# EAGLE design MainBoard5 (EAGLE 5.10)
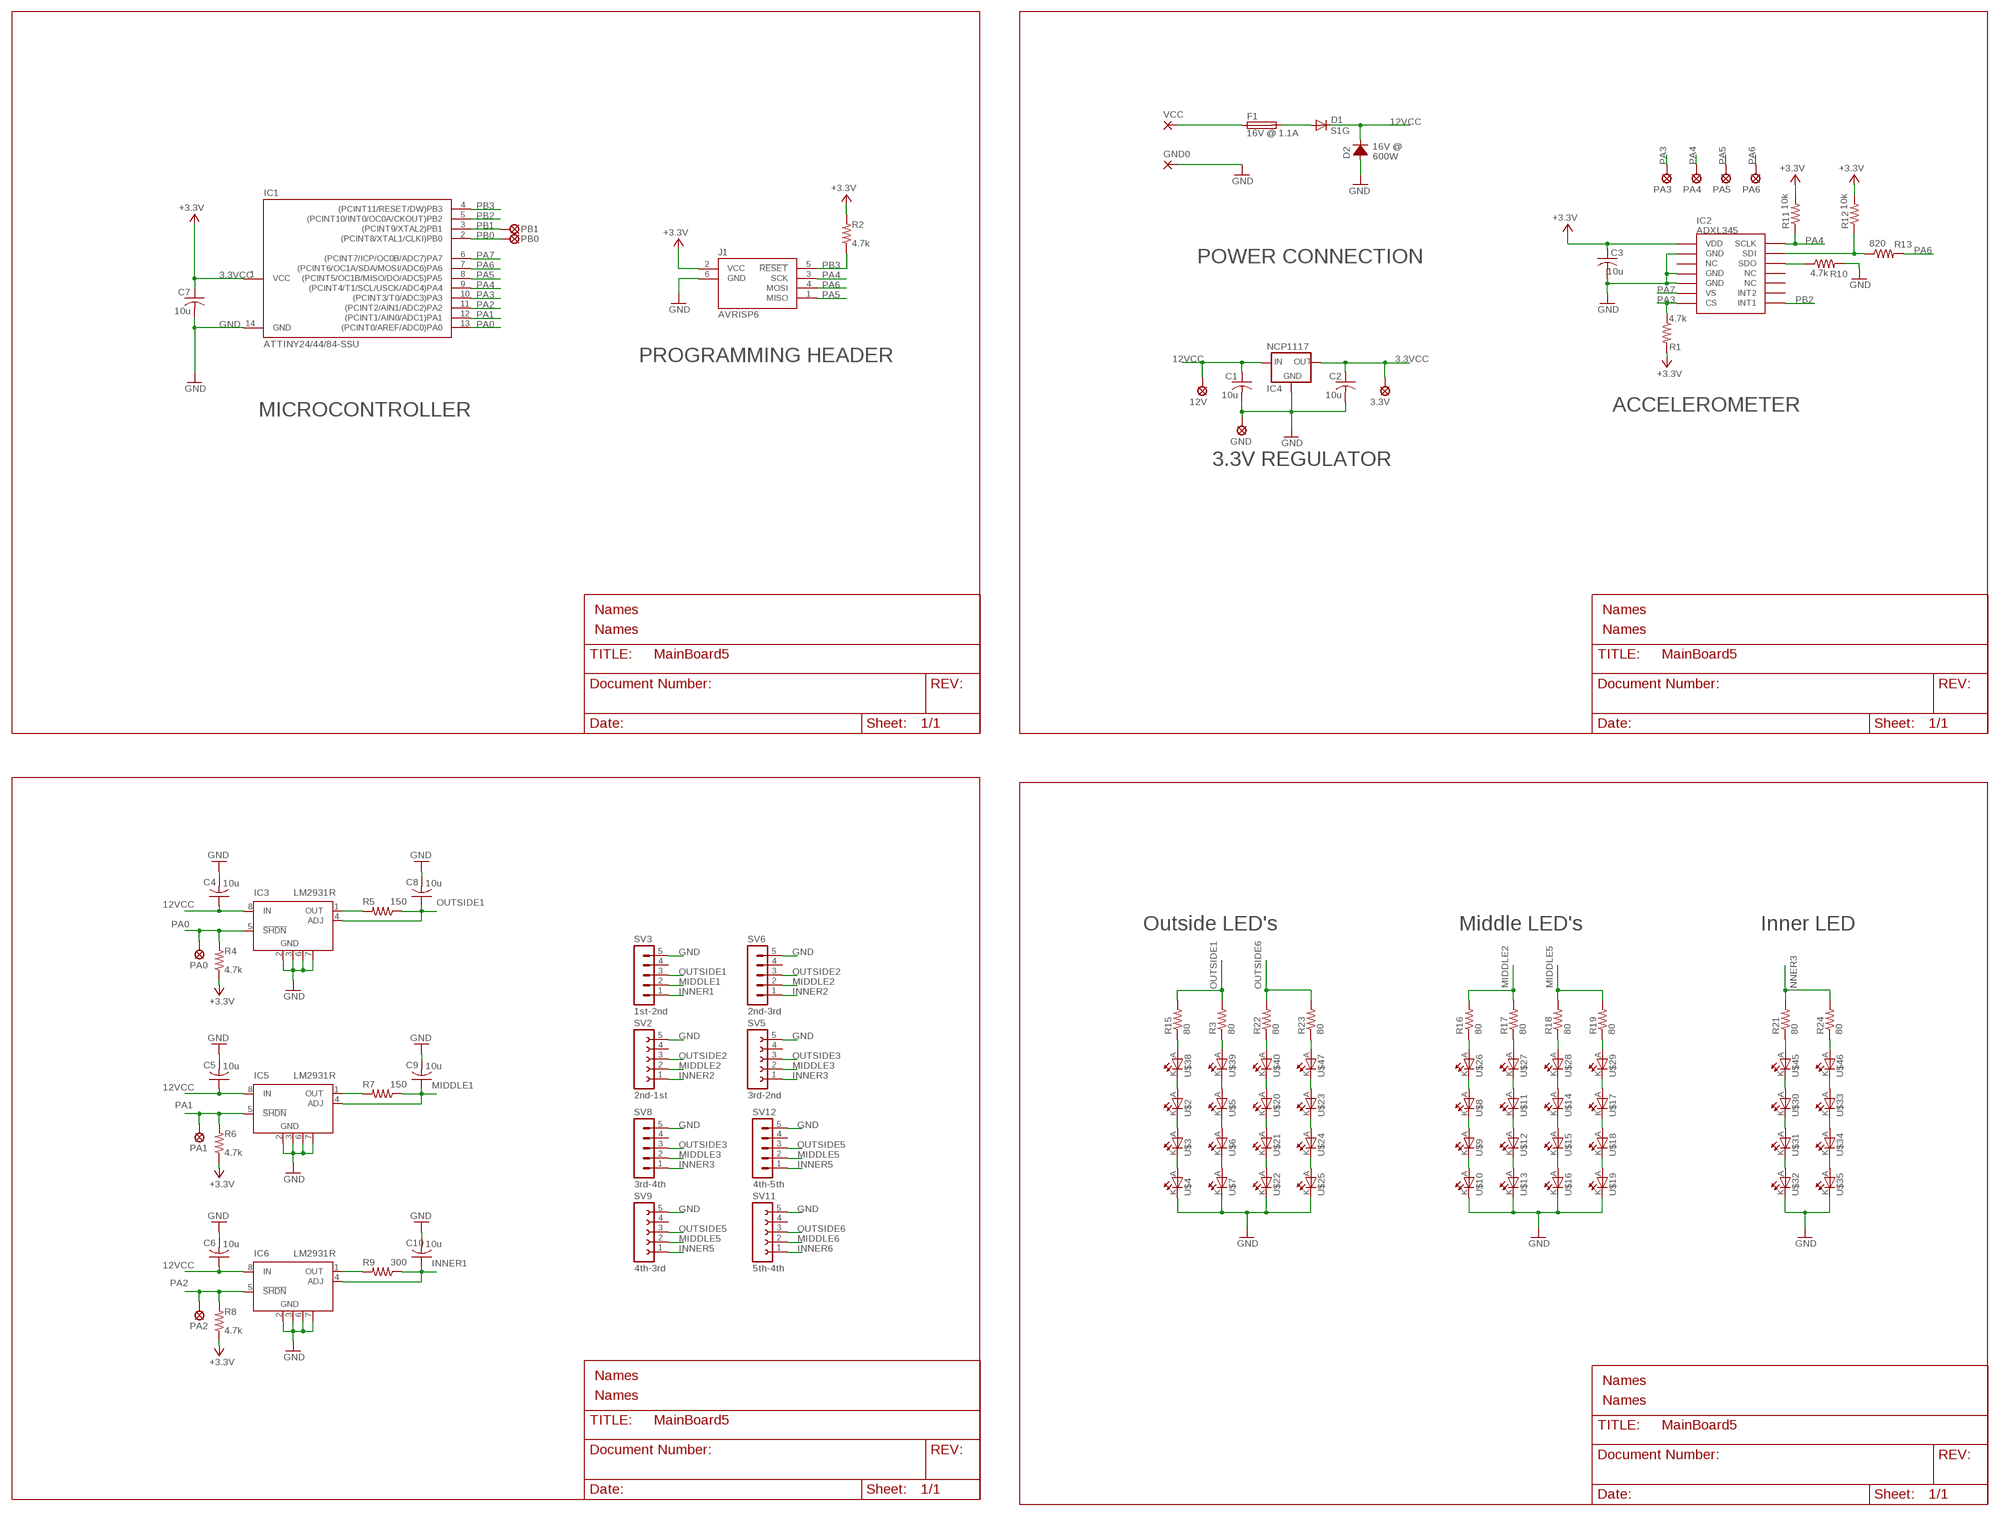
[diagram p0: schematic, sheet 1]

## Parts
3.3V  LSP10  [LSP10]
12V  LSP10  [LSP10]
C1  10u  C-USC0805  [C0805]
C2  10u  C-USC0805  [C0805]
C3  10u  C-USC0805  [C0805]
C4  10u  C-USC0805  [C0805]
C5  10u  C-USC0805  [C0805]
C6  10u  C-USC0805  [C0805]
C7  10u  C-USC0805  [C0805]
C8  10u  C-USC0805  [C0805]
C9  10u  C-USC0805  [C0805]
C10  10u  C-USC0805  [C0805]
D1  S1G  DIODE-DO-214AC  [DO-214AC]
D2  DIODEDO214AA  [DO214AA]
F1  16V @ 1.1A  FUSELITTELFUSE1812  [LITTELFUSE1812]
GND  LSP10  [LSP10]
GND0  WIREPAD2,15/1,0  [2,15/1,0]
IC1  ATTINY24/44/84-SSU  [SOIC14]
IC2  ADXL345  [LGA14]
IC3  LM2931R  [SOIC8]
IC4  NCP1117  LD1117DPAK  [DPAK]
IC5  LM2931R  [SOIC8]
IC6  LM2931R  [SOIC8]
J1  AVRISP6  [CON6P2R]
PA0  LSP10  [LSP10]
PA1  LSP10  [LSP10]
PA2  LSP10  [LSP10]
PA3  LSP10  [LSP10]
PA4  LSP10  [LSP10]
PA5  LSP10  [LSP10]
PA6  LSP10  [LSP10]
PB0  LSP10  [LSP10]
PB1  LSP10  [LSP10]
R1  4.7k  R-US_R0805  [R0805]
R2  4.7k  R-US_R0805  [R0805]
R3  80  R-US_R0805  [R0805]
R4  4.7k  R-US_R0805  [R0805]
R5  150  R-US_R0805  [R0805]
R6  4.7k  R-US_R0805  [R0805]
R7  150  R-US_R0805  [R0805]
R8  4.7k  R-US_R0805  [R0805]
R9  300  R-US_R0805  [R0805]
R10  4.7k  R-US_R0805  [R0805]
R11  10k  R-US_R0805  [R0805]
R12  10k  R-US_R0805  [R0805]
R13  820  R-US_R0805  [R0805]
R15  80  R-US_R0805  [R0805]
R16  80  R-US_R0805  [R0805]
R17  80  R-US_R0805  [R0805]
R18  80  R-US_R0805  [R0805]
R19  80  R-US_R0805  [R0805]
R21  80  R-US_R0805  [R0805]
R22  80  R-US_R0805  [R0805]
R23  80  R-US_R0805  [R0805]
R24  80  R-US_R0805  [R0805]
SV2  2nd-1st  FE05-1  [FE05-1]
SV3  1st-2nd  MA05-1  [MA05-1]
SV5  3rd-2nd  FE05-1  [FE05-1]
SV6  2nd-3rd  MA05-1  [MA05-1]
SV8  3rd-4th  MA05-1  [MA05-1]
SV9  4th-3rd  FE05-1  [FE05-1]
SV11  5th-4th  FE05-1  [FE05-1]
SV12  4th-5th  MA05-1  [MA05-1]
U$2  LED5.0MM  [LED5.0MM]
U$3  LED5.0MM  [LED5.0MM]
U$4  LED5.0MM  [LED5.0MM]
U$5  LED5.0MM  [LED5.0MM]
U$6  LED5.0MM  [LED5.0MM]
U$7  LED5.0MM  [LED5.0MM]
U$8  LED5.0MM  [LED5.0MM]
U$9  LED5.0MM  [LED5.0MM]
U$10  LED5.0MM  [LED5.0MM]
U$11  LED5.0MM  [LED5.0MM]
U$12  LED5.0MM  [LED5.0MM]
U$13  LED5.0MM  [LED5.0MM]
U$14  LED5.0MM  [LED5.0MM]
U$15  LED5.0MM  [LED5.0MM]
U$16  LED5.0MM  [LED5.0MM]
U$17  LED5.0MM  [LED5.0MM]
U$18  LED5.0MM  [LED5.0MM]
U$19  LED5.0MM  [LED5.0MM]
U$20  LED5.0MM  [LED5.0MM]
U$21  LED5.0MM  [LED5.0MM]
U$22  LED5.0MM  [LED5.0MM]
U$23  LED5.0MM  [LED5.0MM]
U$24  LED5.0MM  [LED5.0MM]
U$25  LED5.0MM  [LED5.0MM]
U$26  LED5.0MM  [LED5.0MM]
U$27  LED5.0MM  [LED5.0MM]
U$28  LED5.0MM  [LED5.0MM]
U$29  LED5.0MM  [LED5.0MM]
U$30  LED5.0MM  [LED5.0MM]
U$31  LED5.0MM  [LED5.0MM]
U$32  LED5.0MM  [LED5.0MM]
U$33  LED5.0MM  [LED5.0MM]
U$34  LED5.0MM  [LED5.0MM]
U$35  LED5.0MM  [LED5.0MM]
U$38  LED5.0MM  [LED5.0MM]
U$39  LED5.0MM  [LED5.0MM]
U$40  LED5.0MM  [LED5.0MM]
U$45  LED5.0MM  [LED5.0MM]
U$46  LED5.0MM  [LED5.0MM]
U$47  LED5.0MM  [LED5.0MM]
VCC  WIREPAD2,15/1,0  [2,15/1,0]

## Nets
3.3VCC: 3.3V.MP C2.1 C3.1 C7.1 IC1.1(VCC) IC2.VDD IC4.3(OUT) J1.2(VCC) R1.2 R2.2 R4.1 R6.1 R8.1 R11.2 R12.2 ; supply symbol labelled +3.3V
12VCC: 12V.MP C1.1 C4.1 C5.1 C6.1 D1.C D2.C IC3.8(IN) IC4.2(IN) IC5.8(IN) IC6.8(IN)
GND: C1.2 C2.2 C3.2 C4.2 C5.2 C6.2 C7.2 C8.2 C9.2 C10.2 D2.A GND0.1(P) GND.MP IC1.14(GND) IC2.GND$1(GND) IC2.GND$2(GND) IC2.GND$3(GND) IC3.2(GND) IC3.3(GND) IC3.6(GND) IC3.7(GND) IC4.1(GND) IC5.2(GND) IC5.3(GND) IC5.6(GND) IC5.7(GND) IC6.2(GND) IC6.3(GND) IC6.6(GND) IC6.7(GND) J1.6(GND) R10.2 SV2.5 SV3.5 SV5.5 SV6.5 SV8.5 SV9.5 SV11.5 SV12.5 U$4.K(C) U$7.K(C) U$10.K(C) U$13.K(C) U$16.K(C) U$19.K(C) U$22.K(C) U$25.K(C) U$32.K(C) U$35.K(C)
INNER1: C10.1 IC6.4(ADJ) R9.1 SV3.1
INNER2: SV2.1 SV6.1
INNER3: R21.2 R24.2 SV5.1 SV8.1
INNER5: SV9.1 SV12.1
INNER6: SV11.1
MIDDLE1: C9.1 IC5.4(ADJ) R7.1 SV3.2
MIDDLE2: R16.2 R17.2 SV2.2 SV6.2
MIDDLE3: SV5.2 SV8.2
MIDDLE5: R18.2 R19.2 SV9.2 SV12.2
MIDDLE6: SV11.2
N$1: F1.P$1 VCC.1(P)
N$2: IC3.1(OUT) R5.2
N$3: U$3.K(C) U$4.A
N$4: U$2.K(C) U$3.A
N$5: IC2.SDO R10.1
N$6: IC6.1(OUT) R9.2
N$7: IC2.SDI R12.1 R13.1
N$9: IC5.1(OUT) R7.2
N$11: U$2.A U$38.K(C)
N$12: U$5.A U$39.K(C)
N$13: U$9.K(C) U$10.A
N$14: U$6.K(C) U$7.A
N$15: U$5.K(C) U$6.A
N$16: U$20.A U$40.K(C)
N$17: U$8.K(C) U$9.A
N$18: U$12.K(C) U$13.A
N$19: U$11.K(C) U$12.A
N$20: U$23.A U$47.K(C)
N$21: U$15.K(C) U$16.A
N$22: U$14.K(C) U$15.A
N$23: U$18.K(C) U$19.A
N$24: R15.1 U$38.A
N$25: R3.1 U$39.A
N$26: U$17.K(C) U$18.A
N$28: U$8.A U$26.K(C)
N$29: U$11.A U$27.K(C)
N$30: U$14.A U$28.K(C)
N$31: U$17.A U$29.K(C)
N$32: R16.1 U$26.A
N$33: R17.1 U$27.A
N$34: R18.1 U$28.A
N$35: U$21.K(C) U$22.A
N$36: U$20.K(C) U$21.A
N$37: R22.1 U$40.A
N$38: R19.1 U$29.A
N$39: D1.A F1.P$2
N$40: U$24.K(C) U$25.A
N$41: U$23.K(C) U$24.A
N$42: R23.1 U$47.A
N$43: U$31.K(C) U$32.A
N$44: U$30.K(C) U$31.A
N$45: U$34.K(C) U$35.A
N$46: U$33.K(C) U$34.A
N$52: U$30.A U$45.K(C)
N$53: U$33.A U$46.K(C)
N$56: R21.1 U$45.A
N$57: R24.1 U$46.A
OUTSIDE1: C8.1 IC3.4(ADJ) R3.2 R5.1 R15.2 SV3.3
OUTSIDE2: SV2.3 SV6.3
OUTSIDE3: SV5.3 SV8.3
OUTSIDE5: SV9.3 SV12.3
OUTSIDE6: R22.2 R23.2 SV11.3
PA0: IC1.13((PCINT0/AREF/ADC0)PA0) IC3.5(!SHDN) PA0.MP R4.2
PA1: IC1.12((PCINT1/AIN0/ADC1)PA1) IC5.5(!SHDN) PA1.MP R6.2
PA2: IC1.11((PCINT2/AIN1/ADC2)PA2) IC6.5(!SHDN) PA2.MP R8.2
PA3: IC1.10((PCINT3/T0/ADC3)PA3) IC2.CS PA3.MP R1.1
PA4: IC1.9((PCINT4/T1/SCL/USCK/ADC4)PA4) IC2.SCLK J1.3(SCK) PA4.MP R11.1
PA5: IC1.8((PCINT5/OC1B/MISO/DO/ADC5)PA5) J1.1(MISO) PA5.MP
PA6: IC1.7((PCINT6/OC1A/SDA/MOSI/ADC6)PA6) J1.4(MOSI) PA6.MP R13.2
PA7: IC1.6((PCINT7/ICP/OC0B/ADC7)PA7) IC2.VS
PB0: IC1.2((PCINT8/XTAL1/CLKI)PB0) PB0.MP
PB1: IC1.3((PCINT9/XTAL2)PB1) PB1.MP
PB2: IC1.5((PCINT10/INT0/OC0A/CKOUT)PB2) IC2.INT1
PB3: IC1.4((PCINT11/RESET/DW)PB3) J1.5(!RESET) R2.1
Unconnected: IC2.INT2 IC2.NC$1(NC) IC2.NC$2(NC) IC2.NC$3(NC) SV2.4 SV3.4 SV5.4 SV6.4 SV8.4 SV9.4 SV11.4 SV12.4

## Notes on the sheet
- 16V @
- 600W
- POWER CONNECTION
- PROGRAMMING HEADER
- MICROCONTROLLER | ACCELEROMETER
- 3.3V REGULATOR
- Names | Names
- Names | Names
- Outside LED's | Middle LED's | Inner LED
- Names
- Names
- Names
- Names

## Library data of the parts
3.3V 12V GND PA0 PA1-PA6 PB0 PB1 = solpad:LSP10: SOLDER PAD drill 1.0 mm, distributor Buerklin, 12H555
C1-C10 = rcl:C-US: CAPACITOR, American symbol
D1 = diode:DIODE-: DIODE
D2 = ads4:DIODE: Diode Contains packages not in Eagle libraries
F1 = ads4:FUSE: Fuse
GND0 VCC = wirepad:WIREPAD: Wire PAD connect wire on PCB
IC1 = attiny24_44_84:ATTINY24/44/84
IC2 = tt_pulse:ADXL345
IC3 IC5 IC6 = linear-technology_pace:LM2931R
IC4 = ads4:LD1117: Fixed 3-terminal voltage regulator
J1 = ads4:AVRISP6: 6-pin dual-row connector for Atmel AVRISP programmer interface
R1-R13 R15-R19 R21-R24 = rcl:R-US_: RESISTOR, American symbol
SV2 SV5 SV9 SV11 = con-lsta:FE05-1: FEMALE HEADER; OC_FARNELL: unknown; OC_NEWARK: unknown
SV3 SV6 SV8 SV12 = con-lstb:MA05-1: PIN HEADER; OC_FARNELL: unknown; OC_NEWARK: unknown
U$2-U$35 U$38-U$40 U$45-U$47 = led:LED5.0MM

## Board
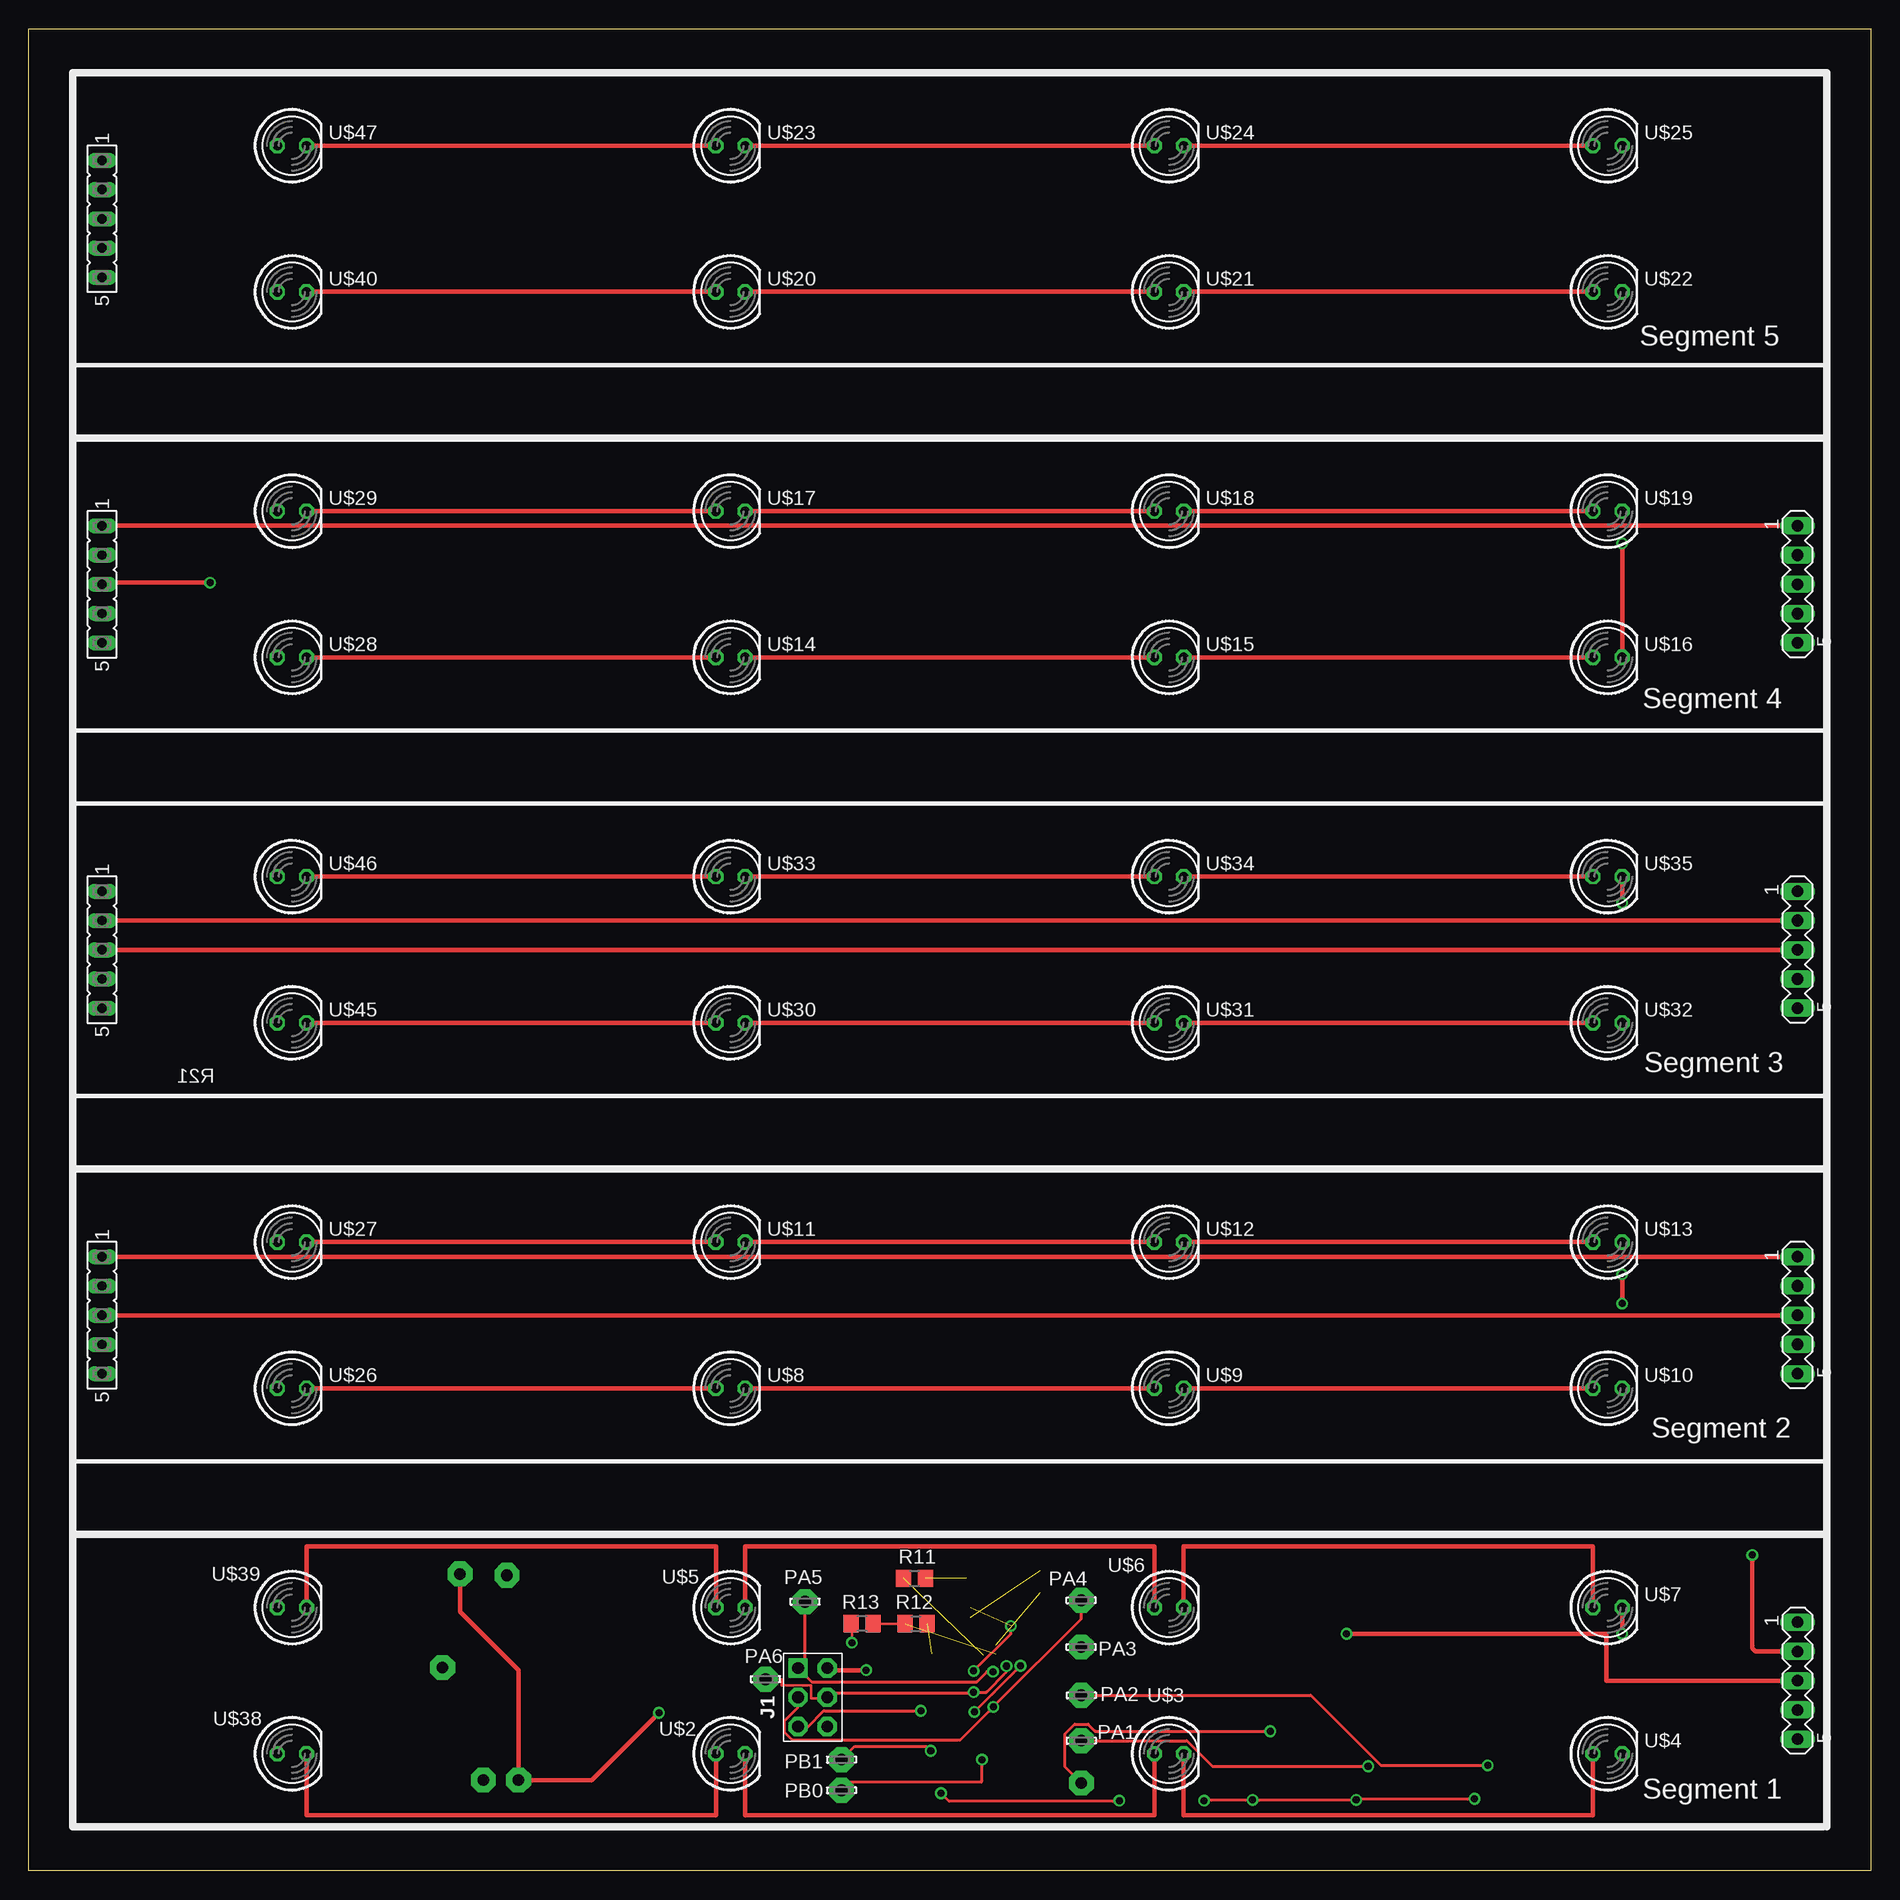
[diagram p1: board, top side]
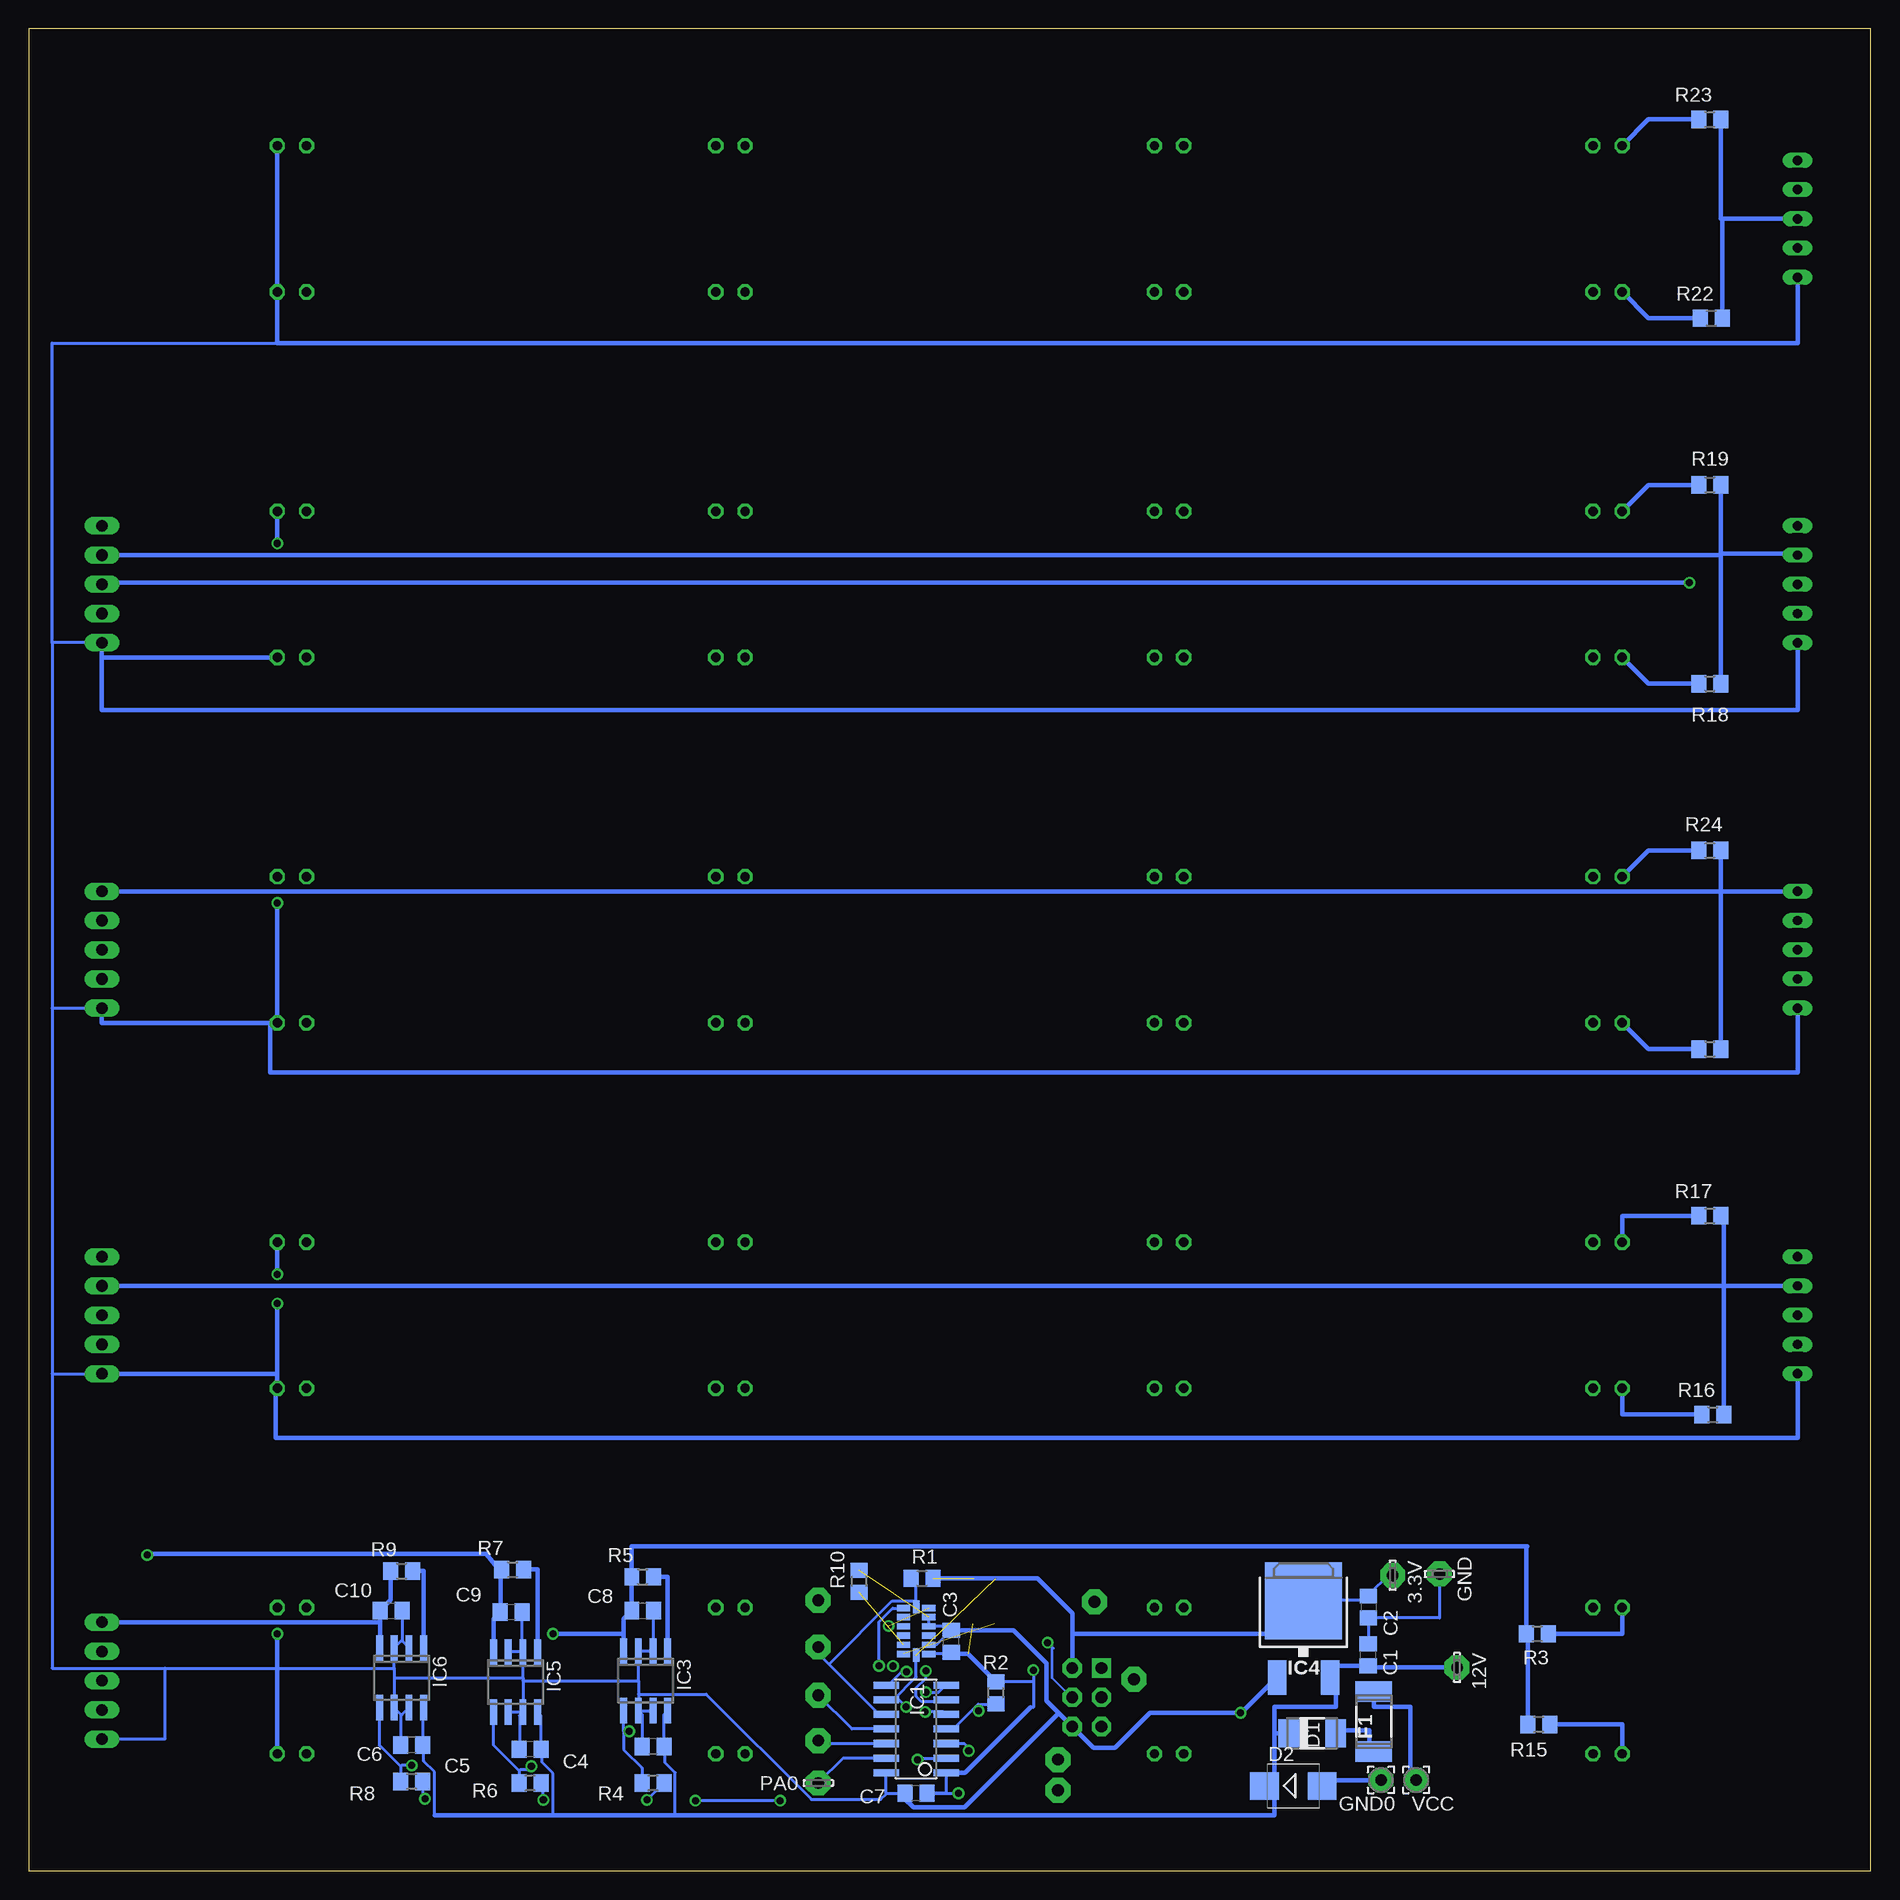
[diagram p2: board, bottom side, seen from below]

Size 160.02 x 160.02 mm. Coordinates in mm from the lower left corner, seen from the top.
Outline: 0,0 0,160.02 160.02,160.02 160.02,0 0,0
Copper layers (1*16): Top 0.035mm / dielectric 1.5mm / Bottom 0.035mm
Design rules "fab": minimum track width 8mil, minimum drill 24mil, track to track 8mil, track to pad 8mil, pad to pad 8mil, via to via 8mil, smd to smd 8mil, copper to edge 20mil, drill to drill 8mil, minimum pad ring 10mil, minimum via ring 8mil, stop-mask expansion 0mil, vias tented up to drill 0mil, thermal gap 10mil

### Footprints (pad centres in the part's own frame; a part is rotated, then mirrored left to right if it is on the bottom)
LSP10 = drill 1.016 pad 2.159 octagon: MP 0,0
C0805 = smd 1.3 x 1.5: 1 -0.95,0; 2 0.95,0
DO-214AC = smd 1.8 x 2.4: A 2.025,0; C -2.025,0
DO214AA = smd 2.5 x 2.4: A 2.5,0; C -2.5,0
LITTELFUSE1812 = smd 1.778 x 3.15: P$1 2.603,0; P$2 -2.603,0
2,15/1,0 = drill 1.016 pad 2.159 octagon: 1 0,0
SOIC14 = smd 0.61 x 2.21: 1 -3.81,-2.603; 2 -2.54,-2.603; 3 -1.27,-2.603; 4 0,-2.603; 5 1.27,-2.603; 6 2.54,-2.603; 7 3.81,-2.603; 8 3.81,2.603; 9 2.54,2.603; 10 1.27,2.603; 11 0,2.603; 12 -1.27,2.603; 13 -2.54,2.603; 14 -3.81,2.603
LGA14 = smd 0.55 x 1.145: CS 0,-2.098; SCLK 0,2.098 | smd 1.145 x 0.55: GND$1 -1.097,1.2; GND$2 -1.097,-0.4; GND$3 -1.097,-1.2; INT1 1.097,-2; INT2 1.097,-1.2; NC$1 -1.097,0.4; NC$2 1.097,-0.4; NC$3 1.097,0.4; SDI 1.097,2; SDO 1.097,1.2; VDD -1.097,2; VS -1.097,-2
SOIC8 = smd 0.6 x 2.2: 1 -1.905,-2.6; 2 -0.635,-2.6; 3 0.635,-2.6; 4 1.905,-2.6; 5 1.905,2.6; 6 0.635,2.6; 7 -0.635,2.6; 8 -1.905,2.6
DPAK = smd 1.6 x 3: 1 -2.3,-4.8; 2 2.3,-4.8 | smd 6.7 x 6.7: 3 0,1.86
CON6P2R = drill 1.016 pad 1.676 square: 1 -2.54,-1.27 | drill 1.016 pad 1.676 octagon: 2 -2.54,1.27; 3 0,-1.27; 4 0,1.27; 5 2.54,-1.27; 6 2.54,1.27
R0805 = smd 1.3 x 1.5: 1 -0.95,0; 2 0.95,0
FE05-1 = drill 0.813 long: 1 -5.08,0; 2 -2.54,0; 3 0,0; 4 2.54,0; 5 5.08,0
MA05-1 = drill 1.016 long: 1 -5.08,0; 2 -2.54,0; 3 0,0; 4 2.54,0; 5 5.08,0
LED5.0MM = drill 0.813 octagon: A -1.27,0; K 1.27,0

### Placement (x,y rotation side)
3.3V  41.53,25.65 270 bottom
12V  35.94,17.65 270 bottom
C1  43.66,18.75 90 bottom
C2  43.64,22.91 270 bottom
C3  79.88,19.94 90 bottom
C4  105.79,10.79 180 bottom
C5  116.46,10.54 180 bottom
C6  126.75,10.92 180 bottom
C7  82.93,6.73 180 bottom
C8  106.68,22.61 0 bottom
C9  118.11,22.48 0 bottom
C10  128.52,22.61 0 bottom
D1  48.51,11.94 0 bottom
D2  50.16,7.37 0 bottom
F1  43.18,12.95 90 bottom
GND  37.47,25.78 0 bottom
GND0  42.55,7.87 0 bottom
IC1  82.93,12.32 90 bottom
IC2  82.93,20.83 180 bottom
IC3  106.43,16.51 180 bottom
IC4  49.28,21.59 0 bottom
IC5  117.73,16.38 180 bottom
IC6  127.64,16.76 180 bottom
J1  68.1,15.06 270 top
PA0  91.44,7.62 0 bottom
PA1  91.44,11.3 0 top
PA2  91.44,15.24 0 top
PA3  91.44,19.43 180 top
PA4  91.44,23.5 180 top
PA5  67.44,23.37 180 top
PA6  64.01,16.64 180 top
PB0  70.61,6.99 0 top
PB1  70.61,9.65 0 top
R1  82.42,25.4 0 bottom
R2  76,15.44 90 bottom
R3  28.96,20.57 180 bottom
R4  105.79,7.62 180 bottom
R5  106.68,25.53 0 bottom
R6  116.46,7.62 180 bottom
R7  117.98,26.16 0 bottom
R8  126.75,7.75 180 bottom
R9  127.64,26.04 0 bottom
R10  87.88,25.15 90 bottom
R11  76.96,25.4 0 top
R12  77.09,21.46 0 top
R13  72.39,21.46 180 top
R15  28.83,12.7 180 bottom
R16  13.72,39.62 0 bottom
R17  13.97,56.9 0 bottom
R18  13.97,103.12 0 bottom
R19  13.97,120.4 0 bottom
R21  13.97,71.37 0 bottom
R22  13.84,134.87 0 bottom
R23  13.97,152.15 0 bottom
R24  13.97,88.65 0 bottom
SV2  6.35,48.26 270 top
SV3  153.67,16.51 270 top
SV5  6.35,80.01 270 top
SV6  153.67,48.26 270 top
SV8  153.67,80.01 270 top
SV9  6.35,111.76 270 top
SV11  6.35,143.51 270 top
SV12  153.67,111.76 270 top
U$2  60.96,10.16 0 top
U$3  99.06,10.16 0 top
U$4  137.16,10.16 0 top
U$5  60.96,22.86 0 top
U$6  99.06,22.86 0 top
U$7  137.16,22.86 0 top
U$8  60.96,41.91 0 top
U$9  99.06,41.91 0 top
U$10  137.16,41.91 0 top
U$11  60.96,54.61 0 top
U$12  99.06,54.61 0 top
U$13  137.16,54.61 0 top
U$14  60.96,105.41 0 top
U$15  99.06,105.41 0 top
U$16  137.16,105.41 0 top
U$17  60.96,118.11 0 top
U$18  99.06,118.11 0 top
U$19  137.16,118.11 0 top
U$20  60.96,137.16 0 top
U$21  99.06,137.16 0 top
U$22  137.16,137.16 0 top
U$23  60.96,149.86 0 top
U$24  99.06,149.86 0 top
U$25  137.16,149.86 0 top
U$26  22.86,41.91 0 top
U$27  22.86,54.61 0 top
U$28  22.86,105.41 0 top
U$29  22.86,118.11 0 top
U$30  60.96,73.66 0 top
U$31  99.06,73.66 0 top
U$32  137.16,73.66 0 top
U$33  60.96,86.36 0 top
U$34  99.06,86.36 0 top
U$35  137.16,86.36 0 top
U$38  22.86,10.16 0 top
U$39  22.86,22.86 0 top
U$40  22.86,137.16 0 top
U$45  22.86,73.66 0 top
U$46  22.86,86.36 0 top
U$47  22.86,149.86 0 top
VCC  39.5,7.87 0 bottom

### Tracks (layer width: path | path; a pad name or v marks a point on that pad's centre or on a via)
3.3VCC  (via drill 0.61)  (2 unrouted)
  Top 0.254: v125.6,6.25 115.39,6.25 v115.32,6.15 v106.32,6.15 102.16,6.15 v102.11,6.1 | v79.25,6.73 79.88,6.1 v94.74,6.1
  Top 0.406: J1.2 69.55,17.42 v72.75,17.42
  Bottom 0.254: 79.88,18.83 IC2.VDD | 80.09,8.69 80.21,8.56 IC1.1 80.33,6.73 C7.1 v79.25,6.73 | 3.3V.MP 41.86,25.65 43.51,24.13 C2.1 43.74,23.8 44.07,23.47 49.28,23.47 IC4.3 49.38,23.39 | R2.2 76,16.41 | R2.2 75.92,16.31 | 81.81,25.7 81.74,25.78 R1.2 81.71,25.04 | R4.1 v106.32,6.15 v106.31,6.15 R4.1 | v115.32,6.15 115.32,7.44 115.49,7.62 | v125.6,6.25 125.78,6.43 125.78,7.75 R8.1 | v94.74,6.1 v102.11,6.1 | 73.02,14.18 72.75,14.18 v72.75,17.42 72.75,16.39 R2.2
  Bottom 0.406: 49.38,23.39 52.2,20.57 69.37,20.57 | 69.37,20.57 J1.2 | 69.37,20.57 69.37,22.38 72.39,25.4 R1.2 | 115.49,7.62 R6.1 | 73.02,14.18 78.69,8.51 IC1.1 | R2.2 78.43,18.83 79.88,18.83 C3.1
12VCC
  Bottom 0.254: D2.C 51.82,7.37 51.82,7.62 | IC6.8 125.73,14.15 125.78,14.1 125.78,10.92 C6.1 125.7,10.82 125.7,9.53 124.77,8.59 124.77,4.83 | IC5.8 115.82,13.77 115.52,13.46 C5.1 115.44,10.44 115.44,9.42 114.48,8.46 114.48,4.83 | IC3.8 104.52,13.89 104.83,13.59 104.83,10.79 C4.1 104.75,10.69 104.75,9.4 103.86,8.51 103.86,4.83
  Bottom 0.406: 51.82,11.94 D1.C | 51.82,11.94 51.82,14.22 46.47,14.22 46.47,16.2 IC4.2 46.98,17.8 C1.1 43.52,17.65 12V.MP | 51.82,11.94 51.82,7.62 51.82,4.83 103.86,4.83 114.48,4.83 124.77,4.83
GND  (via drill 0.61)  (1 unrouted)
  Top 0.406: GND.MP 37.47,22.48 42.55,17.4 GND0.1 48.9,7.87 v54.74,13.72 | v138.43,20.57 U$7.K | v138.43,49.28 v138.43,51.82 | v138.43,84.07 U$35.K | v138.43,115.32 U$16.K
  Bottom 0.254: 85.53,6.73 C7.2 | 85.53,6.73 IC1.14 | 157.99,43.18 157.99,17.6 148.21,17.6 | 157.99,43.18 SV6.5 | 157.99,74.93 157.99,43.18 | 157.99,74.93 SV8.5 | 157.99,106.68 157.99,74.93 | SV12.5 157.99,106.68 | C1.2 43.64,19.7 C2.2 37.47,21.96 GND.MP | C3.2 79.88,21.23 IC2.GND$2 IC2.GND$3 | IC2.GND$1 81.14,19.63 C3.2 | C3.2 79.78,20.83 | C7.2 84.02,6.71 | C4.2 106.76,10.79 106.76,13.59 107.06,13.89 IC3.6 | IC3.7 105.79,13.89 106.88,13.89 IC3.6 | C8.2 105.74,19.18 105.79,19.13 IC3.2 105.89,19.13 107.06,19.13 IC3.3 107.06,16.51 | 107.06,16.51 107.06,15.34 | 107.06,15.34 IC3.6 | 127.71,13.54 127.71,13.59 128.27,14.15 IC6.6 128.27,16.76 | 127.71,13.54 C6.2 | IC6.7 127,14.15 127.61,13.54 127.71,13.54 | 127.56,19.99 127.56,19.94 127,19.38 IC6.2 | 127.56,19.99 127.56,22.61 C10.2 | 127.56,19.99 127.66,19.99 128.27,19.38 IC6.3 128.27,17.6 | 128.27,17.6 128.27,16.76 | C5.2 117.4,13.46 117.09,13.77 IC5.7 | IC5.6 118.36,13.77 117.27,13.77 IC5.7 | C9.2 117.14,22.48 117.14,19.05 117.09,19 IC5.2 | IC5.3 118.36,19 117.25,19 IC5.2 | 117.09,16.76 117.09,16.51 | 117.09,16.51 IC5.7 | 117.09,16.76 IC5.2 | 128.27,16.76 117.09,16.76 | 117.09,16.51 107.06,16.51 | C3.2 79.65,20.8 | C7.2 83.8,6.53 | 107.06,15.34 101.17,15.34 92.02,6.2 86,6.2 85.52,6.68 85.53,6.73 | 148.21,17.6 138.43,17.6 128.27,17.6 | 138.43,132.72 157.99,132.72 157.99,106.68 | SV3.5 148.21,11.43 148.21,17.6
  Bottom 0.406: GND0.1 47.66,7.87 D2.A | IC4.1 54.65,13.72 v54.74,13.72 62.61,13.72 65.66,10.67 67.51,10.67 J1.6 70.52,13.68 | C3.2 74.48,20.89 71.63,18.03 71.63,14.78 70.52,13.68 | 70.52,13.68 70.57,13.68 78.74,5.51 83.17,5.51 83.88,6.22 C7.2 | U$4.K 138.43,17.6 v138.43,20.57 | U$25.K U$22.K 138.43,132.72 6.35,132.72 SV11.5 | SV6.5 138.43,43.18 | 138.43,43.18 U$10.K 138.56,41.91 138.56,37.59 6.35,37.59 SV2.5 | v138.43,51.82 U$13.K | 138.43,43.18 v138.43,49.28 | U$32.K v138.43,84.07 | U$32.K 153.67,73.66 SV8.5 | U$16.K 153.67,105.41 SV12.5 153.67,100.84 6.35,100.84 SV9.5 | 138.43,115.44 v138.43,115.32 U$19.K | SV5.5 6.35,69.34 139.06,69.34 139.06,73.66 U$32.K
INNER1
  Bottom 0.254: 129.49,19.43 129.54,19.38 IC6.4 | 129.49,22.61 C10.1 129.41,22.71 | R9.1
  Bottom 0.406: 129.49,19.43 129.49,21.59 | 129.49,21.59 129.49,22.61 | R9.1 128.6,23.52 129.41,22.71 | 129.49,21.59 SV3.1
INNER2
  Top 0.406: SV2.1 SV6.1
INNER3
  Bottom 0.406: 13.02,85.09 SV5.1 | 13.02,85.09 13.02,85.6 R24.2 | 13.02,85.09 SV8.1 | R21.2 13.02,85.09
INNER5
  Top 0.406: SV12.1 SV9.1
MIDDLE1  (via drill 0.61)
  Top 0.406: v149.73,27.43 149.73,19.3 149.99,19.05 SV3.2
  Bottom 0.254: 119.05,26.06 118.95,26.16 R7.1 119.15,26.14 | C9.1 119.13,22.38 119.63,21.87
  Bottom 0.406: C9.1 119.05,26.06 | 119.63,21.87 IC5.4 | 119.15,26.14 120.27,27.51 149.68,27.51 v149.73,27.43
MIDDLE2
  Bottom 0.406: R17.2 12.77,56.9 12.77,50.8 | R16.2 12.77,50.8 | 12.77,50.8 12.32,50.8 SV2.2 | 12.77,50.8 SV6.2
MIDDLE3
  Top 0.406: SV5.2 SV8.2
MIDDLE5
  Bottom 0.406: 13.02,114.3 R18.2 | 13.02,114.43 R19.2 | SV9.2 6.35,114.43 13.02,114.43 | 13.02,114.3 13.02,114.43 | SV12.2 13.02,114.3
N$1
  Bottom 0.406: VCC.1 40.01,7.87 40.01,14.22 43.18,14.22 F1.P$1
N$2
  Bottom 0.254: R5.2 105.72,25.53
  Bottom 0.406: IC3.1 104.52,25.53 R5.2
N$3
  Top 0.406: U$4.A 135.89,4.83 100.33,4.83 U$3.K
N$4
  Top 0.406: U$2.K 62.23,4.83 97.79,4.83 U$3.A
N$5  (1 unrouted)
N$6
  Bottom 0.254: R9.2 126.67,26.04
  Bottom 0.406: IC6.1 125.73,26.04 R9.2
N$7  (1 unrouted)
  Top 0.203: R13.1 R12.1
N$9
  Bottom 0.254: R7.2 117.02,26.16
  Bottom 0.406: IC5.1 115.82,26.16 R7.2
N$11
  Top 0.406: U$38.K 24.13,4.83 59.69,4.83 U$2.A
N$12
  Top 0.406: U$39.K 24.13,28.19 59.69,28.19 U$5.A
N$13
  Top 0.406: U$9.K U$10.A
N$14
  Top 0.406: U$6.K 100.33,28.19 135.89,28.19 U$7.A
N$15
  Top 0.406: U$5.K 62.23,28.19 97.79,28.19 U$6.A
N$16
  Top 0.406: U$40.K U$20.A
N$17
  Top 0.406: U$8.K U$9.A
N$18
  Top 0.406: U$12.K U$13.A
N$19
  Top 0.406: U$11.K U$12.A
N$20
  Top 0.406: U$47.K U$23.A
N$21
  Top 0.406: U$15.K U$16.A
N$22
  Top 0.406: U$14.K U$15.A
N$23
  Top 0.406: U$18.K U$19.A
N$24
  Bottom 0.406: R15.1 21.59,12.7 U$38.A
N$25
  Bottom 0.406: R3.1 21.59,20.57 U$39.A
N$26
  Top 0.406: U$17.K U$18.A
N$28
  Top 0.406: U$26.K U$8.A
N$29
  Top 0.406: U$27.K U$11.A
N$30
  Top 0.406: U$28.K U$14.A
N$31
  Top 0.406: U$29.K U$17.A
N$32
  Bottom 0.406: R16.1 21.59,39.62 U$26.A
N$33
  Bottom 0.406: U$27.A 21.59,56.9 R17.1
N$34
  Bottom 0.406: R18.1 19.3,103.12 U$28.A
N$35
  Top 0.406: U$22.A U$21.K
N$36
  Top 0.406: U$20.K U$21.A
N$37
  Bottom 0.406: R22.1 19.3,134.87 U$40.A
N$38
  Bottom 0.406: R19.1 19.3,120.4 U$29.A
N$39
  Bottom 0.406: F1.P$2 43.56,10.35 43.56,12.19 46.49,12.19 D1.A
N$40
  Top 0.406: U$25.A U$24.K
N$41
  Top 0.406: U$23.K U$24.A
N$42
  Bottom 0.406: R23.1 19.3,152.15 U$47.A
N$43
  Top 0.406: U$31.K U$32.A
N$44
  Top 0.406: U$30.K U$31.A
N$45
  Top 0.406: U$34.K U$35.A
N$46
  Top 0.406: U$33.K U$34.A
N$52
  Top 0.406: U$45.K U$30.A
N$53
  Top 0.406: U$46.K U$33.A
N$56
  Bottom 0.406: R21.1 19.3,71.37 U$45.A
N$57
  Bottom 0.406: R24.1 19.3,88.65 U$46.A
OUTSIDE1  (via drill 0.61)
  Top 0.406: SV3.3 137.03,16.51 137.03,20.57 v114.48,20.57
  Bottom 0.254: C8.1 107.7,22.5
  Bottom 0.406: 108.33,20.57 108.33,21.87 107.7,22.5 | 108.33,20.57 IC3.4 | 108.33,20.57 v114.48,20.57 | R15.2 29.78,20.57 R3.2 29.91,28.19 | 29.91,28.19 29.84,28.19 | 29.91,28.19 107.63,28.19 R5.1 C8.1
OUTSIDE2
  Top 0.406: SV2.3 SV6.3
OUTSIDE3
  Top 0.406: SV5.3 SV8.3
OUTSIDE5  (via drill 0.61)
  Top 0.406: v15.75,111.89 6.48,111.89 SV9.3
  Bottom 0.406: v15.75,111.89 153.67,111.89 SV12.3
OUTSIDE6
  Bottom 0.406: 12.89,143.51 12.83,143.51 SV11.3 | R22.2 12.89,143.51 | R23.2 13.02,143.51 12.89,143.51
PA0  (via drill 0.61)
  Top 0.254: v107.85,12.12 92.63,12.12 92.02,12.72 90.86,12.72 90.02,11.89 90.02,9.04 PA0.MP
  Bottom 0.254: 108.33,12.12 108.33,10.52 106.76,8.94 106.76,7.62 R4.2 | 108.33,12.12 IC3.5 | PA0.MP 89.28,9.78 IC1.13 | v107.85,12.12 108.33,12.12
PA1  (via drill 0.61)
  Top 0.254: v116.36,9.07 102.84,9.07 100.61,11.3 PA1.MP
  Bottom 0.254: 117.42,8.69 117.42,7.62 R6.2 | 117.42,8.69 119.63,10.9 IC5.5 | PA1.MP 91.19,11.05 IC1.12 | v116.36,9.07 116.66,8.76 117.32,8.76 117.42,8.69
PA2  (via drill 0.61)
  Top 0.254: v126.75,9.14 117.47,9.14 111.38,15.24 PA2.MP
  Bottom 0.254: 127.71,9.07 R8.2 | 127.71,9.07 129.54,10.9 IC6.5 | PA2.MP 88.52,12.32 IC1.11 | v126.75,9.14 127.61,9.14 127.71,9.07
PA3
  Bottom 0.254: IC1.10 85.65,13.64 86.21,13.64 90.51,17.95 | R1.1 83.62,25.78 82.93,25.09 IC2.CS 83.03,23.44 85.01,23.44 90.51,17.95 | 90.51,17.95 91.44,18.87 PA3.MP
PA4  (via drill 0.61)  (1 unrouted)
  Top 0.254: J1.3 66.83,14.2 65.66,13.03 65.66,12.01 66.32,11.35 80.92,11.35 v83.8,14.22 83.87,14.33 91.44,21.89 PA4.MP
  Bottom 0.254: IC2.SCLK 82.93,16.84 84.91,14.86 IC1.9 84.58,15.01 v83.8,14.22
PA5  (via drill 0.61)
  Top 0.254: v83.77,17.3 83.24,17.3 82.37,16.43 68,16.43 J1.1 67.44,17.17 PA5.MP
  Bottom 0.254: IC1.8 85.39,16.13 84.05,17.48 83.95,17.4 83.87,17.4 v83.77,17.3
PA6  (via drill 0.61)
  Top 0.203: PA6.MP 65.41,16.64 65.41,16.13 67.94,16.13 67.94,14.99 69.37,14.99 J1.4 | v71.5,19.81 71.5,21.46 R13.2
  Top 0.254: v84.94,17.78 84.94,17.27 83.19,15.52 v82.09,15.52 81.99,15.44 69.75,15.44 J1.4
  Bottom 0.203: 71.06,19.37 v71.5,19.81 | 71.06,19.37 70.99,19.3 | J1.4 69.47,15.11 71.12,16.76 71.12,19.3 71.06,19.37
  Bottom 0.254: 80.31,16.13 IC1.7 80.44,16.08 81,15.52 v82.09,15.52
PA7  (via drill 0.61)  (1 unrouted)
  Top 0.254: v85.32,21.26 85.32,20.57 v82.09,17.35
  Bottom 0.254: 80.97,14.86 IC1.6 81.08,14.78 81.18,14.68 82.45,14.68 82.93,15.16 82.93,15.88 82.09,16.71 v82.09,17.35
PB0  (via drill 0.61)
  Top 0.254: v82.8,9.65 82.8,7.75 70.61,7.75 PB0.MP
  Bottom 0.254: IC1.2 82.68,9.78 v82.8,9.65
PB1  (via drill 0.61)
  Top 0.254: PB1.MP 71.75,10.79 77.98,10.79 v78.36,10.41
  Bottom 0.254: v78.36,10.41 78.36,10.67 78.74,11.05 IC1.3
PB2  (via drill 0.61)
  Top 0.254: v82.14,13.79 v86.16,17.8
  Bottom 0.254: v86.16,17.8 86.16,21.61 84.96,22.81 84.05,22.81 IC2.INT1 | v82.14,13.79 80.54,13.79 IC1.5
PB3  (via drill 0.61)
  Top 0.254: J1.5 67.69,12.52 69.06,13.89 v77.5,13.89
  Bottom 0.254: 77.81,14.21 79.7,12.32 IC1.4 | 77.81,14.21 77.55,14.48 76,14.48 R2.1 | v77.5,13.89 77.81,14.21

### Text on the board
tNames: Segment 5 | Segment 4 | Segment 3 | Segment 2 | Segment 1